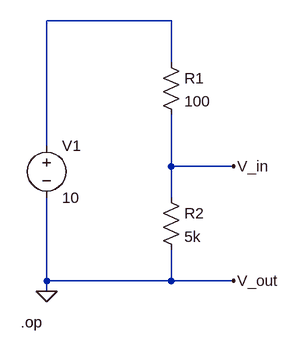
[diagram p0: schematic Voltage_divider.asc]
Voltage_divider.asc, the LTspice schematic file:
Version 4
SHEET 1 880 680
WIRE 288 -64 96 -64
WIRE 288 0 288 -64
WIRE 96 128 96 -64
WIRE 288 160 288 80
WIRE 384 160 288 160
WIRE 288 208 288 160
WIRE 96 336 96 208
WIRE 288 336 288 288
WIRE 288 336 96 336
WIRE 384 336 288 336
WIRE 96 352 96 336
FLAG 384 160 V_in
FLAG 384 336 V_out
FLAG 96 352 0
DATAFLAG 288 160 ""
DATAFLAG 288 336 ""
SYMBOL voltage 96 112 R0
WINDOW 123 0 0 Left 0
WINDOW 39 0 0 Left 0
SYMATTR InstName V1
SYMATTR Value 10
SYMBOL res 272 -16 R0
SYMATTR InstName R1
SYMATTR Value 100
SYMBOL res 272 192 R0
SYMATTR InstName R2
SYMATTR Value 5k
TEXT 56 400 Left 2 !.op

The netlist it stands for:
* Voltage_divider.asc
V1 N001 0 10
R1 N001 V_in 100
R2 V_in 0 5k
.op
.backanno
.end